# EAGLE design ICL7660 (EAGLE 7.3.0)
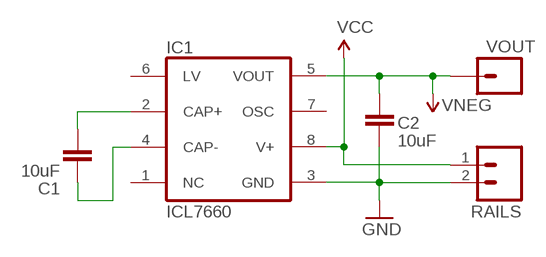
[diagram p0: schematic, sheet 1]

## Parts
C1  10uF  CAPACITOR_NPOL-1206  [C1206]
C2  10uF  CAPACITOR_NPOL-1206  [C1206]
IC1  ICL7660  ICL7660CSA  [SO08]
RAILS  M02PTH  [1X02]
VOUT  M01PTH  [1X01]

## Nets
GND: C2.2 IC1.3(GND) RAILS.2
N$1: C1.2 IC1.2(CAP+)
N$2: C1.1 IC1.4(CAP-)
VCC: IC1.8(V+) RAILS.1
VNEG: C2.1 IC1.5(VOUT) VOUT.1
Unconnected: IC1.1(NC) IC1.6(LV) IC1.7(OSC)

## Library data of the parts
C1 C2 = dp_devices:CAPACITOR_NPOL: Non-Polarized capacitor in various packages
IC1 = maxim:ICL7660CSA: VOLTAGE CONVERTER; MF: MAXIM; MPN: ICL7660CSA; OC_FARNELL: 9724710; OC_NEWARK: 34C3732
RAILS = SparkFun-Connectors:M02: Standard 2-pin 0.1" header. Use with - straight break away headers ( PRT-00116) - right angle break away headers (PRT-00553) - swiss pins (PRT-00743) - machine pins (PRT-00117) - female headers (PRT-00115) Molex polarized connector foot print use with: PRT-08233 with associated crimp pins and housings. 2.54_SCREWTERM for use with PRT-10571. 3.5mm Screw Terminal footprints for PRT-08084 5mm Screw Terminal footprints for use with PRT-08432
VOUT = SparkFun-Connectors:M01: Header 1 Standard 1-pin 0.1" header. Use with straight break away headers (SKU : PRT-00116), right angle break away headers (PRT-00553), swiss pins (PRT-00743), machine pins (PRT-00117), and female headers (PRT-00115).

## Board
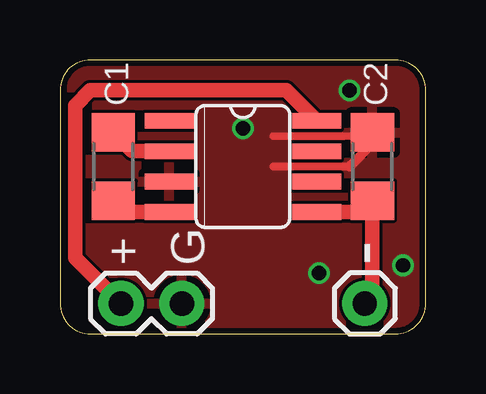
[diagram p1: board, top side]
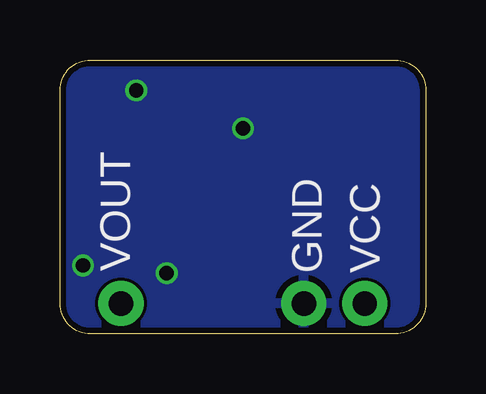
[diagram p2: board, bottom side, seen from below]

Size 15.24 x 11.43 mm. Coordinates in mm from the lower left corner, seen from the top.
Outline: 0,10.16 0,1.27 arc90 1.27,0 13.97,0 arc90 15.24,1.27 15.24,10.16 arc90 13.97,11.43 1.27,11.43 arc90 0,10.16
Copper layers (1*16): Top 0.035mm / dielectric 1.5mm / Bottom 0.035mm
Design rules "dirt_cheap_dirty_boards.v1": minimum track width 5mil, minimum drill 12mil, track to track 5mil, track to pad 5mil, pad to pad 5mil, via to via 5mil, smd to smd 0mil, copper to edge 10mil, drill to drill 10mil, minimum pad ring 10mil, minimum via ring 6mil, stop-mask expansion 2mil, vias tented up to drill 25mil, thermal gap 10mil

### Footprints (pad centres in the part's own frame; a part is rotated, then mirrored left to right if it is on the bottom)
C1206 = smd 1.6 x 1.803: 1 -1.422,0; 2 1.422,0
SO08 = smd 0.66 x 2.032: 1 -1.905,-3.073; 2 -0.635,-3.073; 3 0.635,-3.073; 4 1.905,-3.073; 5 1.905,3.073; 6 0.635,3.073; 7 -0.635,3.073; 8 -1.905,3.073
1X02 = drill 1.016 pad 1.88: 1 0,0; 2 2.54,0
1X01 = drill 1.016 pad 1.88: 1 0,0

### Placement (x,y rotation side)
C1  2.22,6.99 90 top
C2  13.02,6.99 90 top
IC1  7.62,6.99 270 top
RAILS  2.54,1.27 0 top
VOUT  12.7,1.27 0 top

### Tracks (layer width: path | path; a pad name or v marks a point on that pad's centre or on a via)
GND  (via drill 0.6)
  Top 0.305: 12.87,8.26 8.89,8.26 | 8.89,6.99 12.06,6.99
  Top 0.406: 12.87,8.26 C2.2 13.02,7.94 12.06,6.99
  other vias: 7.62,8.57 12.06,10.16 14.29,2.86 10.79,2.54
  pour Top: 0,0 15.24,0 15.24,11.43 0,11.43
  pour Bottom: 0,0 15.24,0 15.24,11.43 0,11.43
N$1
  Top 0.61: IC1.2 3.01,7.62 C1.2
N$2
  Top 0.61: IC1.4 2.71,5.08 C1.1
VCC
  Top 0.61: RAILS.1 0.64,3.17 0.64,9.53 1.27,10.16 9.42,10.16 IC1.8
VNEG
  Top 0.61: IC1.5 12.53,5.08 C2.1 13.02,1.59 VOUT.1

### Text on the board
tNames: + / G | -
bNames: GND / VCC